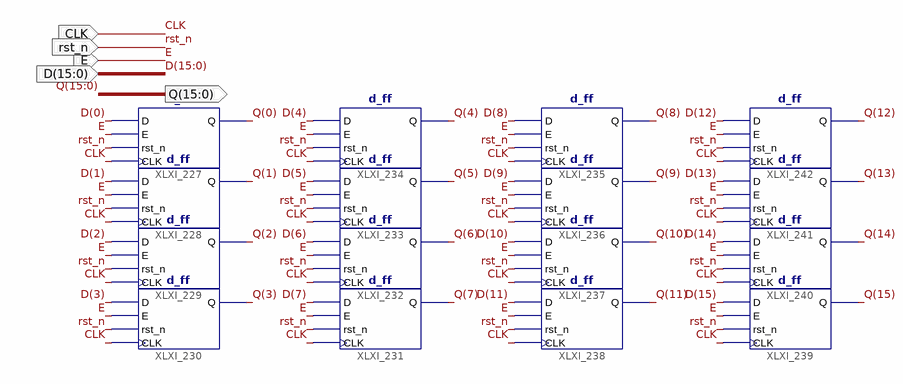
[diagram p0: schematic sheet 1]
// Xilinx ISE schematic d_ff_16bit.sch (virtex6) as structural Verilog: 16 symbols, 5 ports
module d_ff_16bit (
  input  E,
  input  CLK,
  input  [15:0] D,
  input  rst_n,
  output [15:0] Q
);

  d_ff XLXI_227 (.E(E), .D(D[0]), .Q(Q[0]), .CLK(CLK), .rst_n(rst_n));
  d_ff XLXI_228 (.E(E), .D(D[1]), .Q(Q[1]), .CLK(CLK), .rst_n(rst_n));
  d_ff XLXI_229 (.E(E), .D(D[2]), .Q(Q[2]), .CLK(CLK), .rst_n(rst_n));
  d_ff XLXI_230 (.E(E), .D(D[3]), .Q(Q[3]), .CLK(CLK), .rst_n(rst_n));
  d_ff XLXI_231 (.E(E), .D(D[7]), .Q(Q[7]), .CLK(CLK), .rst_n(rst_n));
  d_ff XLXI_232 (.E(E), .D(D[6]), .Q(Q[6]), .CLK(CLK), .rst_n(rst_n));
  d_ff XLXI_233 (.E(E), .D(D[5]), .Q(Q[5]), .CLK(CLK), .rst_n(rst_n));
  d_ff XLXI_234 (.E(E), .D(D[4]), .Q(Q[4]), .CLK(CLK), .rst_n(rst_n));
  d_ff XLXI_235 (.E(E), .D(D[8]), .Q(Q[8]), .CLK(CLK), .rst_n(rst_n));
  d_ff XLXI_236 (.E(E), .D(D[9]), .Q(Q[9]), .CLK(CLK), .rst_n(rst_n));
  d_ff XLXI_237 (.E(E), .D(D[10]), .Q(Q[10]), .CLK(CLK), .rst_n(rst_n));
  d_ff XLXI_238 (.E(E), .D(D[11]), .Q(Q[11]), .CLK(CLK), .rst_n(rst_n));
  d_ff XLXI_239 (.E(E), .D(D[15]), .Q(Q[15]), .CLK(CLK), .rst_n(rst_n));
  d_ff XLXI_240 (.E(E), .D(D[14]), .Q(Q[14]), .CLK(CLK), .rst_n(rst_n));
  d_ff XLXI_241 (.E(E), .D(D[13]), .Q(Q[13]), .CLK(CLK), .rst_n(rst_n));
  d_ff XLXI_242 (.E(E), .D(D[12]), .Q(Q[12]), .CLK(CLK), .rst_n(rst_n));
endmodule
